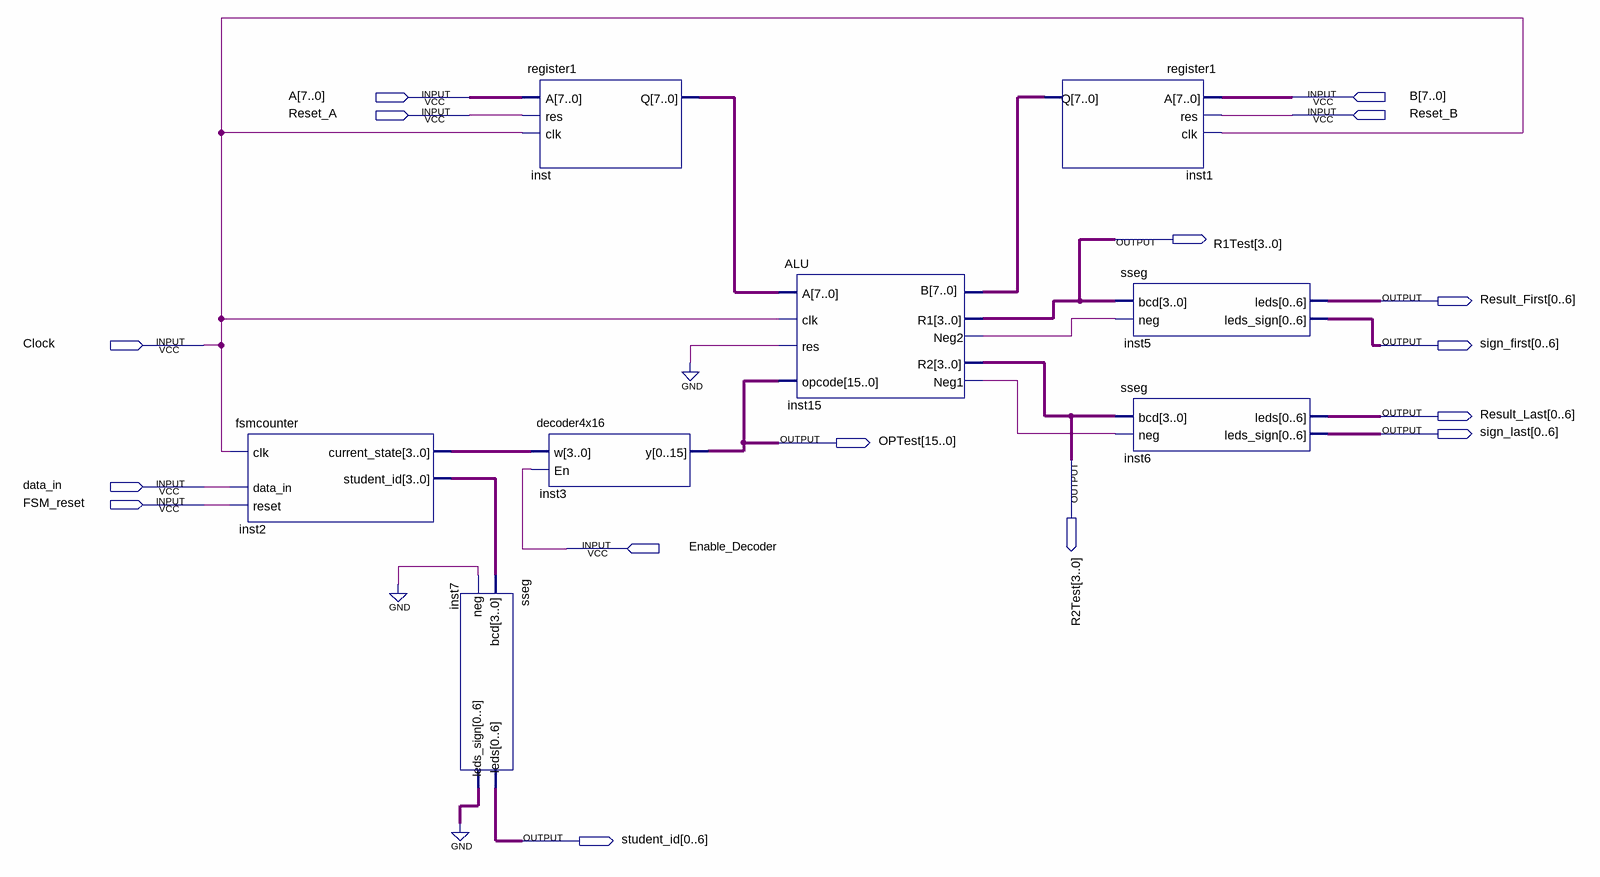
[diagram p0: schematic sheet]
// Quartus schematic Lab6_Part1.bdf as structural Verilog: 8 symbols, 16 pins
module Lab6_Part1 (
  input  [7:0] A,
  input  [7:0] B,
  input  Reset_A,
  input  Reset_B,
  input  Clock,
  input  data_in,
  input  FSM_reset,
  input  Enable_Decoder,
  output [3:0] R1Test,
  output [0:6] Result_First,
  output [0:6] sign_first,
  output [0:6] Result_Last,
  output [0:6] sign_last,
  output [15:0] OPTest,
  output [3:0] R2Test,
  output [0:6] student_id
);

  wire inst15_neg1, inst15_neg2;
  wire [3:0] inst2_current_state, inst2_student_id;
  wire [6:0] inst7_leds_sign;
  wire [7:0] inst1_q, inst_q;

  fsmcounter inst2 (
    .data_in(data_in), .clk(Clock), .reset(FSM_reset), .student_id(inst2_student_id),
    .current_state(inst2_current_state));
  sseg inst7 (.bcd(inst2_student_id), .neg(1'b0), .leds(student_id), .leds_sign(inst7_leds_sign));
  register1 inst (.A(A), .res(Reset_A), .clk(Clock), .Q(inst_q));
  decoder4x16 inst3 (.w(inst2_current_state), .En(Enable_Decoder), .y(OPTest));
  ALU inst15 (
    .clk(Clock), .res(1'b0), .A(inst_q), .B(inst1_q), .opcode(OPTest), .Neg1(inst15_neg1),
    .Neg2(inst15_neg2), .R1(R1Test), .R2(R2Test));
  register1 inst1 (.A(B), .res(Reset_B), .clk(Clock), .Q(inst1_q));
  sseg inst5 (.bcd(R1Test), .neg(inst15_neg2), .leds(Result_First), .leds_sign(sign_first));
  sseg inst6 (.bcd(R2Test), .neg(inst15_neg1), .leds(Result_Last), .leds_sign(sign_last));
  // also tied to GND on the sheet: {inst7_leds_sign[0], inst7_leds_sign[1], inst7_leds_sign[2], inst7_leds_sign[3], inst7_leds_sign[4], inst7_leds_sign[5], inst7_leds_sign[6]}
endmodule
